# EAGLE design board (EAGLE 7.2.0)
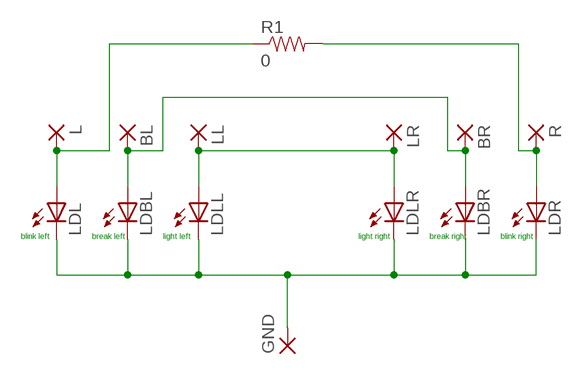
[diagram p0: schematic, sheet 1]

## Parts
BL  SMD2  [SMD1,27-2,54]
BR  SMD2  [SMD1,27-2,54]
GND  SMD2  [SMD1,27-2,54]
L  SMD2  [SMD1,27-2,54]
LDBL  LEDCHIP-LED0603  [CHIP-LED0603]
LDBR  LEDCHIP-LED0603  [CHIP-LED0603]
LDL  LEDCHIP-LED0603  [CHIP-LED0603]
LDLL  LEDCHIP-LED0603  [CHIP-LED0603]
LDLR  LEDCHIP-LED0603  [CHIP-LED0603]
LDR  LEDCHIP-LED0603  [CHIP-LED0603]
LL  SMD2  [SMD1,27-2,54]
LR  SMD2  [SMD1,27-2,54]
R  SMD2  [SMD1,27-2,54]
R1  0  1.5KOHM-1/10W-1%(0603)  [0603]

## Nets
N$1: GND.1(P) LDBL.C LDBR.C LDL.C LDLL.C LDLR.C LDR.C
N$2: L.1(P) LDL.A R1.1
N$3: BL.1(P) BR.1(P) LDBL.A LDBR.A
N$4: LDLL.A LDLR.A LL.1(P) LR.1(P)
N$7: LDR.A R1.2 R.1(P)

## Notes on the sheet
- blink left | break left | light left | light right | break right | blink right

## Library data of the parts
BL BR GND L LL LR R = wirepad:SMD2: SMD PAD
LDBL LDBR LDL LDLL LDLR LDR = led:LED: LED OSRAM: - CHIPLED LG R971, LG N971, LY N971, LG Q971, LY Q971, LO R971, LY R971 LH N974, LH R974 LS Q976, LO Q976, LY Q976 LO Q996 - Hyper CHIPLED LW Q18S LB Q993, LB Q99A, LB R99A - SideLED LS A670, LO A670, LY A670, LG A670, LP A670 LB A673, LV A673, LT A673, LW A673 LH A674 LY A675 LS A676, LA A676, LO A676, LY A676, LW A676 LS A679, LY A679, LG A679 - Hyper Micro SIDELED® LS Y876, LA Y876, LO Y876, LY Y876 LT Y87S - SmartLED LW L88C, LW L88S LB L89C, LB L89S, LG L890 LS L89K, LO L89K, LY L89K LS L896, LA L896, LO L896, LY L896 - TOPLED LS T670, LO T670, LY T670, LG T670, LP T670 LSG T670, LSP T670, LSY T670, LOP T670, LYG T670 LG T671, LOG T671, LSG T671 LB T673, LV T673, LT T673, LW T673 LH T674 LS T676, LA T676, LO T676, LY T676, LB T676, LH T676, LSB T676, LW T676 LB T67C, LV T67C, LT T67C, LS T67K, LO T67K, LY T67K, LW E67C LS E67B, LA E67B, LO E67B, LY E67B, LB E67C, LV E67C, LT E67C LW T67C LS T679, LY T679, LG T679 LS T770, LO T770, LY T770, LG T770, LP T770 LB T773, LV T773, LT T773, LW T773 LH T774 LS E675, LA E675, LY E675, LS T675 LS T776, LA T776, LO T776, LY T776, LB T776 LHGB T686 LT T68C, LB T68C - Hyper Mini TOPLED® LB M676 - Mini TOPLED Santana® LG M470 LS M47K, LO M47K, LY M47K Source: http://www.osram.convergy.de LUXEON: - LUMILED® LXK2-PW12-R00, LXK2-PW12-S00, LXK2-PW14-U00, LXK2-PW14-V00 LXK2-PM12-R00, LXK2-PM12-S00, LXK2-PM14-U00 LXK2-PE12-Q00, LXK2-PE12-R00, LXK2-PE12-S00, LXK2-PE14-T00, LXK2-PE14-U00 LXK2-PB12-K00, LXK2-PB12-L00, LXK2-PB12-M00, LXK2-PB14-N00, LXK2-PB14-P00, LXK2-PB14-Q00 LXK2-PR12-L00, LXK2-PR12-M00, LXK2-PR14-Q00, LXK2-PR14-R00 LXK2-PD12-Q00, LXK2-PD12-R00, LXK2-PD12-S00 LXK2-PH12-R00, LXK2-PH12-S00 LXK2-PL12-P00, LXK2-PL12-Q00, LXK2-PL12-R00 Source: www.luxeon.com KINGBRIGHT: KA-3528ASYC Source: www.kingbright.com
R1 = SparkFun-Resistors:1.5KOHM-1/10W-1%(0603): RES-08306; PROD_ID: RES-08306; VALUE: 1.5KOHM

## Board
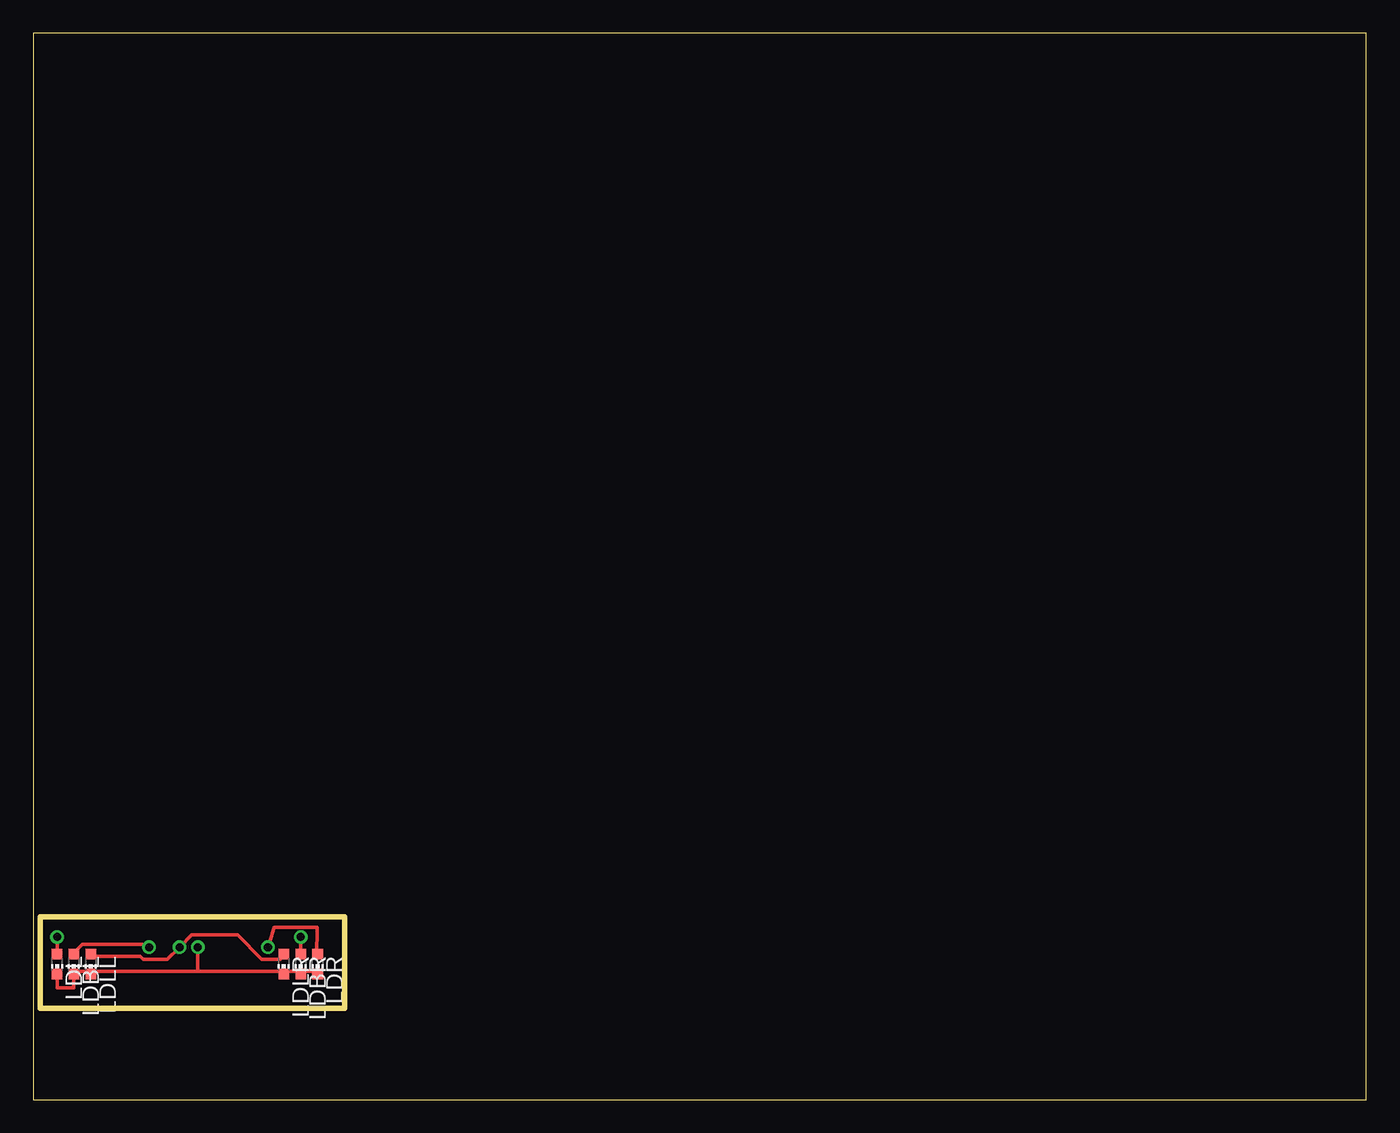
[diagram p1: board, top side]
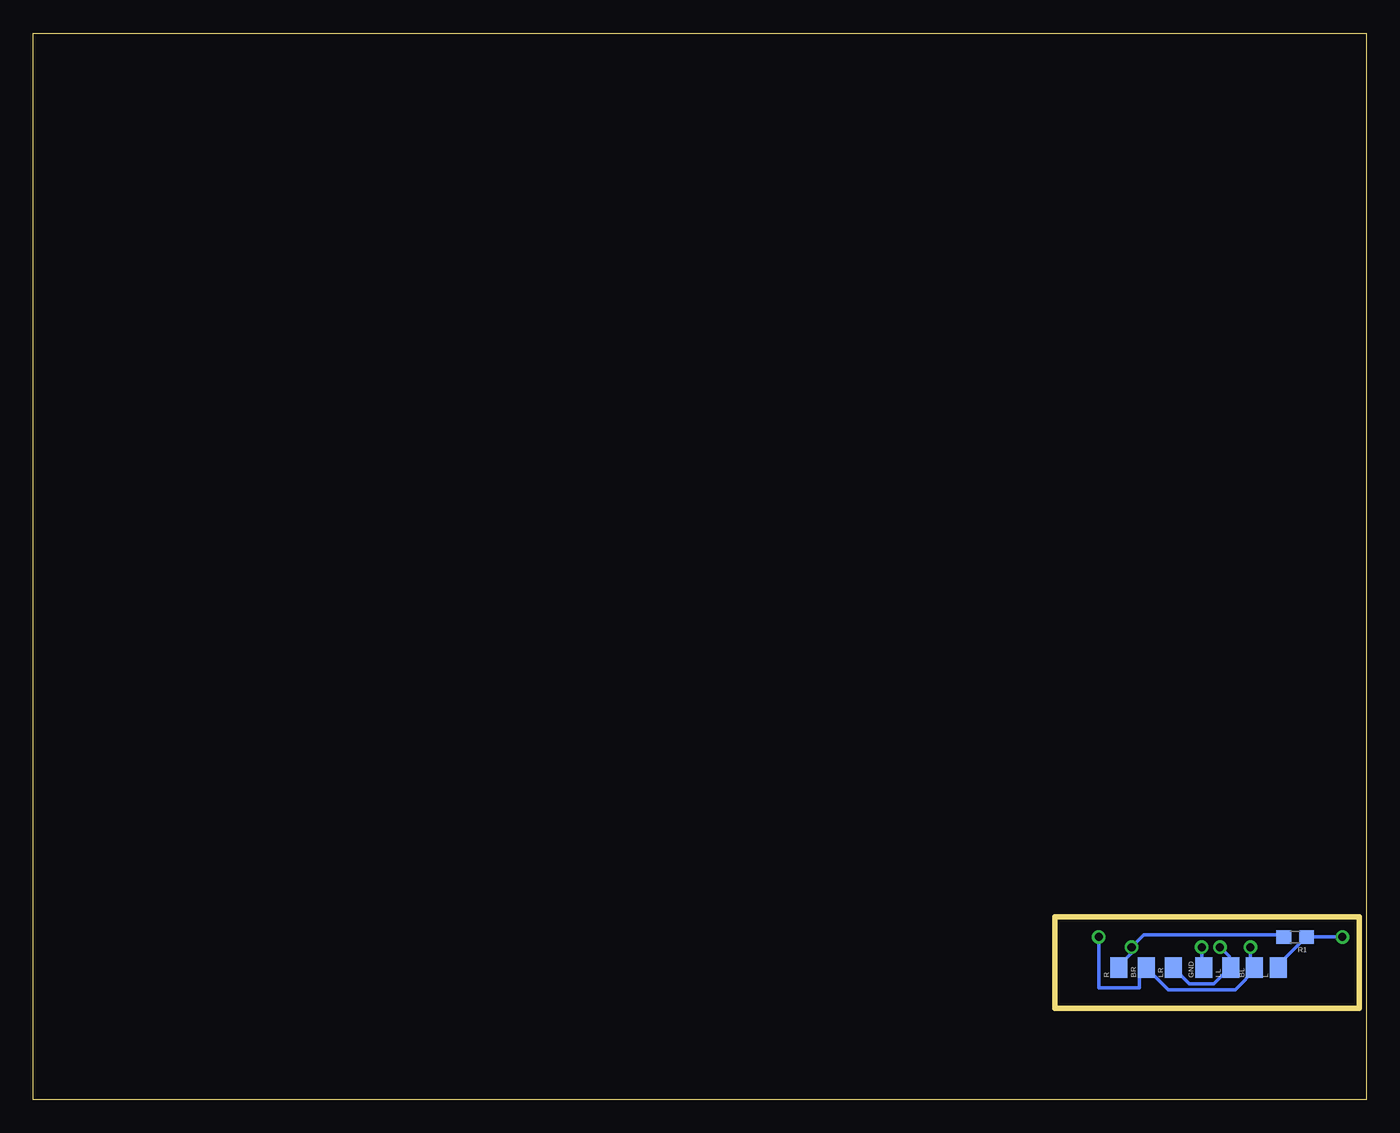
[diagram p2: board, bottom side, seen from below]

Size 100 x 80 mm. Coordinates in mm from the lower left corner, seen from the top.
Outline: 0,0 100,0 100,80 0,80 0,0
Outline: 0.51,13.72 23.37,13.72 23.37,6.86 0.51,6.86 0.51,13.72
Copper layers (1*16): Top 0.035mm / dielectric 1.5mm / Bottom 0.035mm
Design rules "default": minimum track width 10mil, minimum drill 24mil, track to track 8mil, track to pad 8mil, pad to pad 8mil, via to via 8mil, smd to smd 8mil, copper to edge 40mil, drill to drill 8mil, minimum pad ring 10mil, minimum via ring 8mil, stop-mask expansion 4mil, vias tented up to drill 0mil, thermal gap 10mil

### Footprints (pad centres in the part's own frame; a part is rotated, then mirrored left to right if it is on the bottom)
SMD1,27-2,54 = smd 1.27 x 1.524: 1 0,0
CHIP-LED0603 = smd 0.8 x 0.8: A 0,-0.75; C 0,0.75
0603 = smd 1.1 x 1: 1 -0.85,0; 2 0.85,0

### Placement (x,y rotation side)
BL  8.38,9.91 0 bottom
BR  16.51,9.91 0 bottom
GND  12.19,9.91 0 bottom
L  6.6,9.91 0 bottom
LDBL  3.05,10.16 180 top
LDBR  20.07,10.16 180 top
LDL  1.78,10.16 180 top
LDLL  4.32,10.16 180 top
LDLR  18.8,10.16 180 top
LDR  21.34,10.16 180 top
LL  10.16,9.91 0 bottom
LR  14.48,9.91 0 bottom
R  18.54,9.91 0 bottom
R1  5.33,12.19 180 bottom

### Tracks (layer width: path | path; a pad name or v marks a point on that pad's centre or on a via)
N$1  (via drill 0.61)
  Top 0.254: LDR.C 21.26,9.6 20.12,9.6 LDBR.C 19.89,9.6 18.97,9.6 LDLR.C 18.75,9.6 12.34,9.6 | 12.34,9.6 4.34,9.6 LDLL.C 4.12,9.6 3.2,9.6 LDBL.C 3.05,8.38 1.78,8.38 LDL.C | 12.34,9.6 v12.34,11.43
  Bottom 0.254: v12.34,11.43 12.34,10.06 GND.1
N$2  (via drill 0.6)
  Top 0.254: LDL.A v1.78,12.19
  Bottom 0.254: L.1 6.63,10.06 4.57,12.12 R1.1 v1.78,12.19
N$3  (via drill 0.6, 0.61)
  Top 0.254: v8.69,11.43 8.46,11.66 3.66,11.66 3.2,11.2 3.2,10.97 LDBL.A | v20.07,12.19 LDBR.A
  Bottom 0.254: v8.69,11.43 8.69,10.29 8.46,10.06 BL.1 8.23,9.83 9.83,8.23 14.86,8.23 16.46,9.83 BR.1 17.02,9.91 17.02,8.38 20.07,8.38 v20.07,12.19
N$4  (via drill 0.61)
  Top 0.254: LDLL.A 4.34,10.74 8,10.74 8.23,10.52 10.06,10.52 v10.97,11.43 11.89,12.34 15.32,12.34 17.14,10.52 18.52,10.52 18.75,10.74 LDLR.A
  Bottom 0.254: LR.1 13.26,8.69 11.43,8.69 10.29,9.83 LL.1 10.29,10.06 10.29,10.74 v10.97,11.43
N$7  (via drill 0.61)
  Top 0.254: v17.6,11.43 18.09,12.93 21.31,12.93 21.31,12.7 21.26,10.97 LDR.A
  Bottom 0.254: R.1 18.52,10.06 17.6,10.97 v17.6,11.43 16.69,12.34 6.4,12.34 R1.2